# EasyEDA schematic SCH_gravmaskin_mottagare_2024-06-04.json
TITLE: Sheet_1; REV: 1.0; Date: 2024-06-04; Sheet: 1/1; Company: Your Company
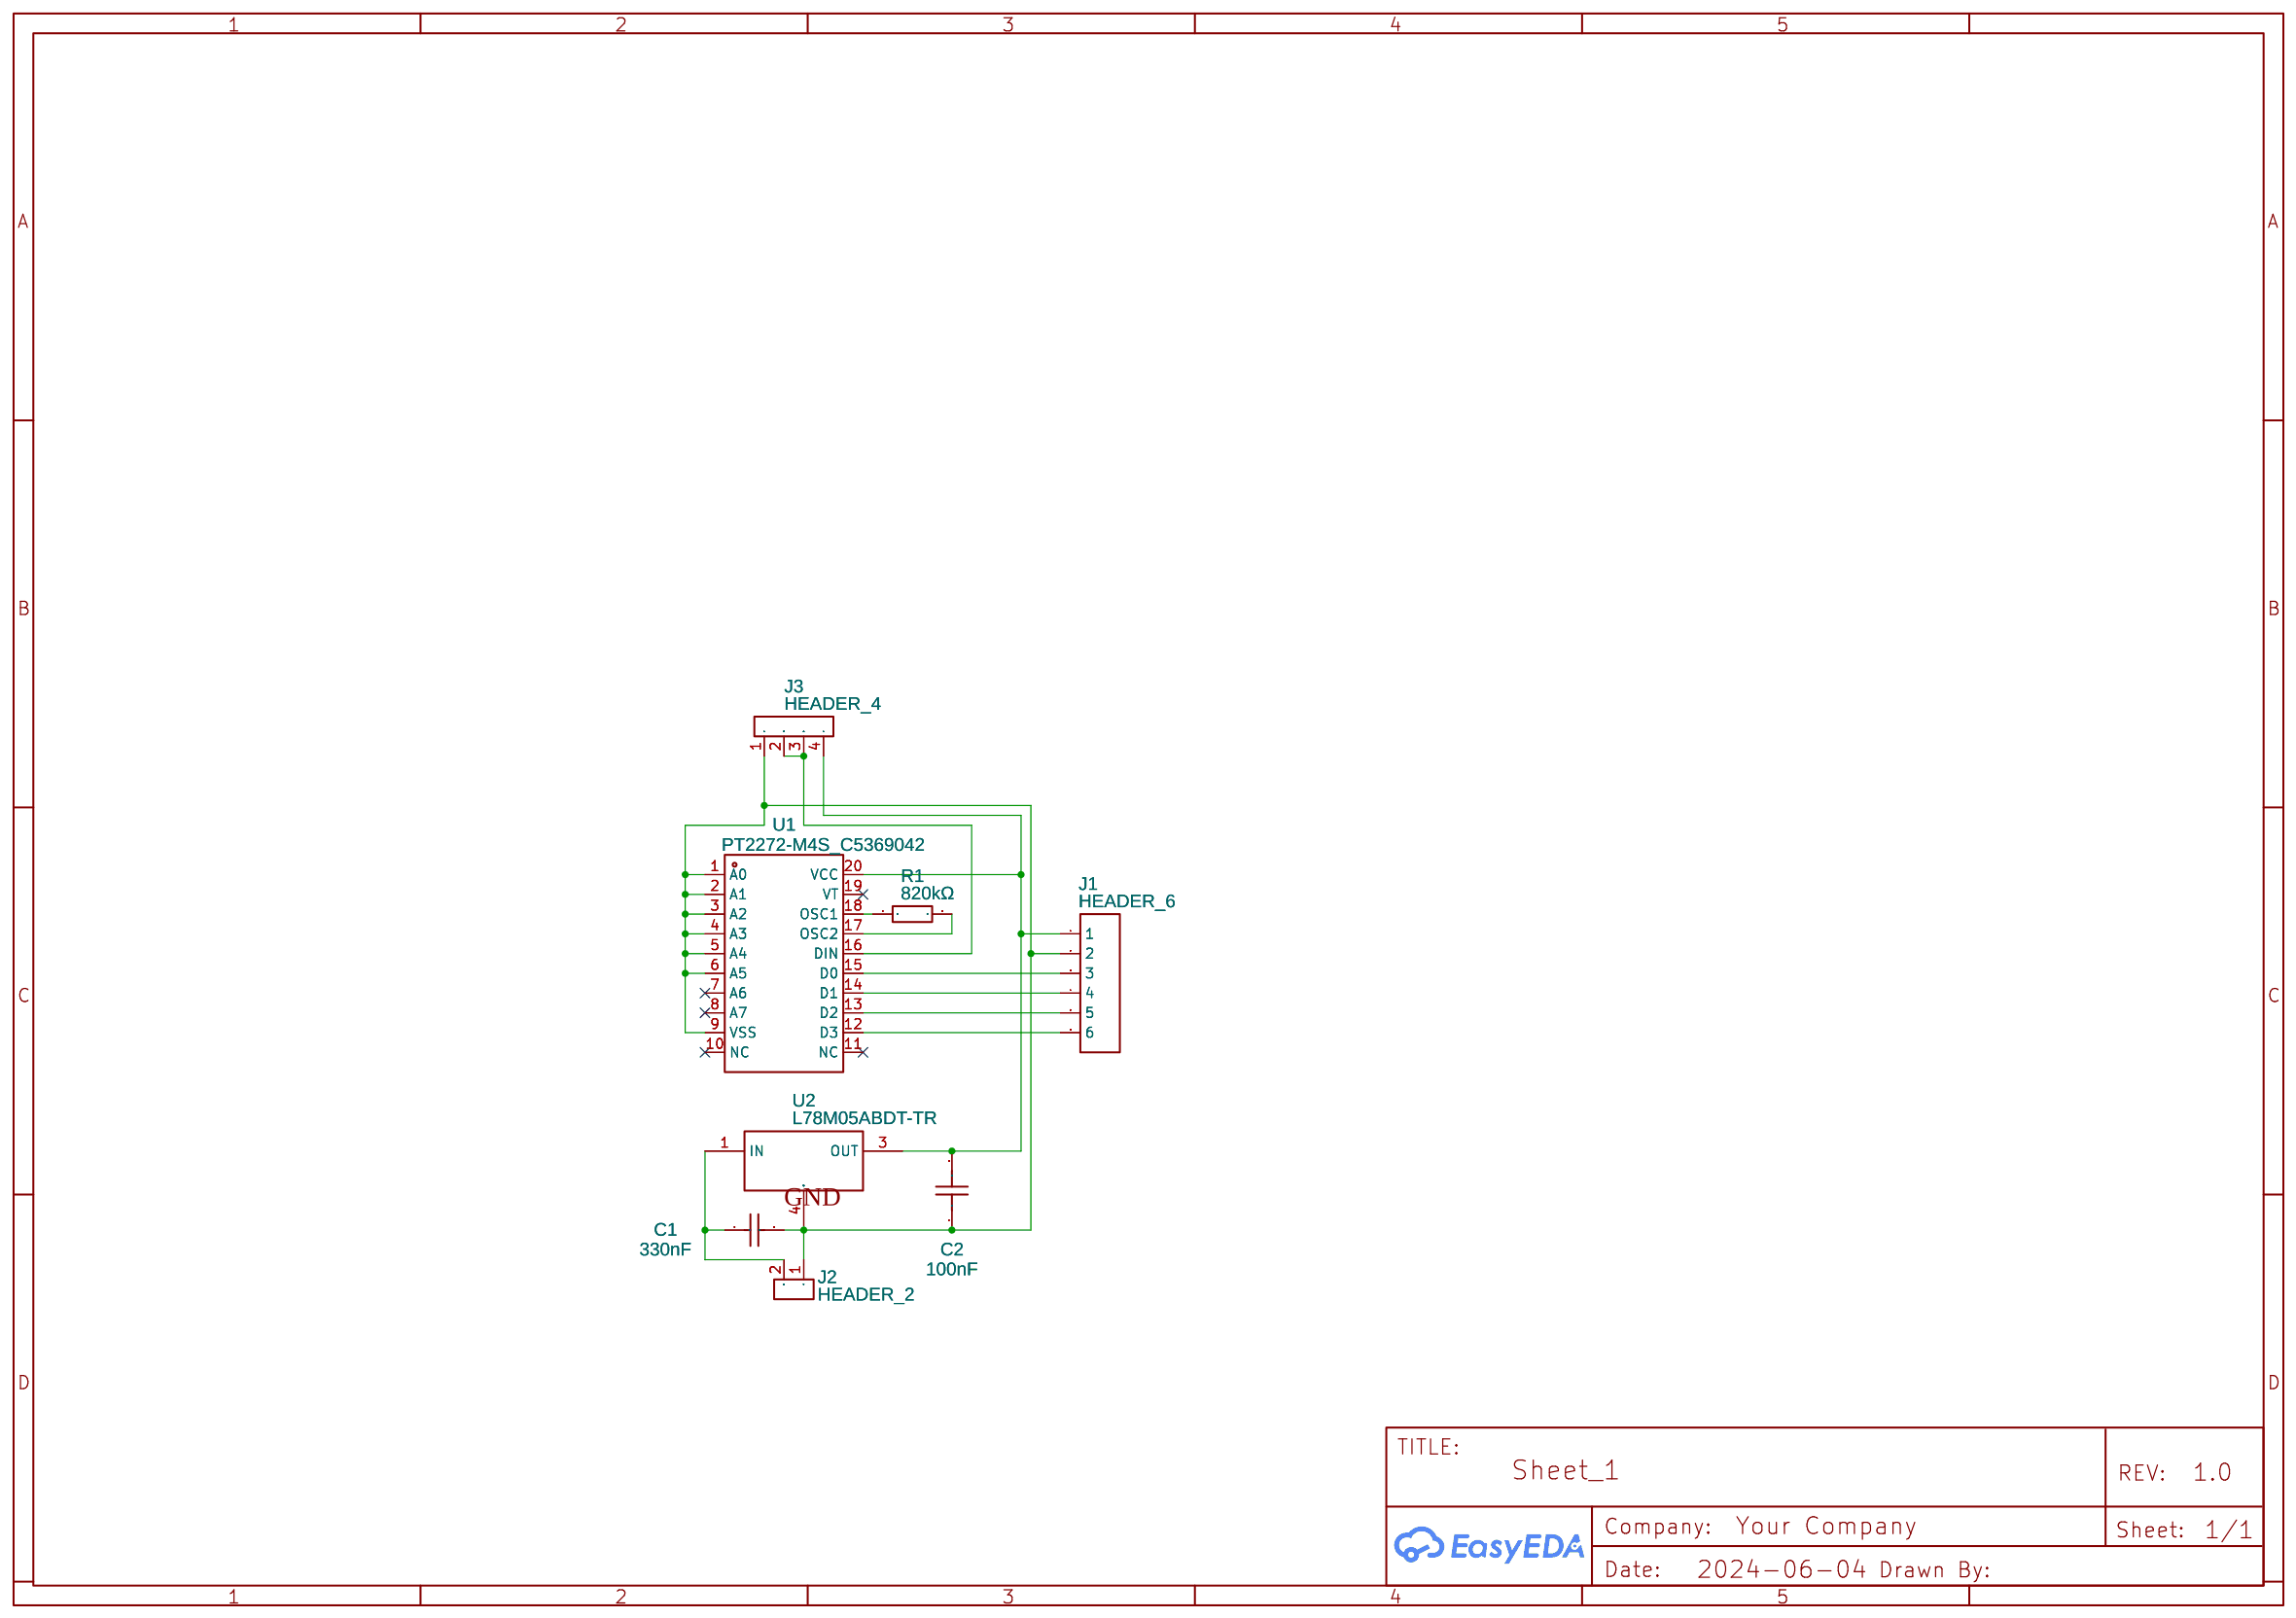
[diagram p0: schematic sheet]

## Parts
C1  330nF  [C0603]
C2  100nF  [C0603]
J1  HEADER_6  [HDR-M-2.54_1X6]
J2  HEADER_2  [1X02]
J3  HEADER_4  [1X04]
R1  820kΩ  [R0201]
U1  PT2272-M4S_C5369042  [SOIC-20_L13.0-W7.6-P1.27-LS10.3-BL]
U2  L78M05ABDT-TR  [TO-252-2_L6.5-W6.1-P4.58-LS10.0-TL]

## Library data of the parts
C1 = 0603B334K250NT: Supplier: LCSC; Manufacturer: FH(风华); Supplier Part: C1615; JLCPCB Part Class: Extended Part
C2 = CC0603KRX7R9BB104: Supplier: LCSC; Manufacturer: YAGEO(国巨); Supplier Part: C14663; JLCPCB Part Class: Basic Part
J1 = HEADER_6
J2 = HEADER_2
J3 = HEADER_4
R1 = RC-01W824JT: Contributor: LCSC; Supplier: LCSC; Supplier Part: C321058; Manufacturer: FH(风华); JLCPCB Part Class: Extended Part
U1 = PT2272-M4S_C5369042: Contributor: lcsc; Supplier: LCSC; Supplier Part: C5369042; Manufacturer: PTC(普诚); Manufacturer Part: PT2272-M4S; JLCPCB Part Class: Extended Part
U2 = L78M05ABDT-TR: Supplier: LCSC; Manufacturer: ST(意法半导体); Supplier Part: C58069; JLCPCB Part Class: Basic Part

## Nets
Net-(C1-1): C1.1 C2.1 J1.2 J2.1 J3.1 U1.1(A0) U1.2(A1) U1.3(A2) U1.4(A3) U1.5(A4) U1.6(A5) U1.9(VSS) U2.4(GND)
Net-(C1-2): C1.2 J2.2 U2.1(IN)
Net-(C2-2): C2.2 J1.1 J3.4 U1.20(VCC) U2.3(OUT)
Net-(J1-3): J1.3 U1.15(D0)
Net-(J1-4): J1.4 U1.14(D1)
Net-(J1-5): J1.5 U1.13(D2)
Net-(J1-6): J1.6 U1.12(D3)
Net-(J3-2): J3.2 J3.3 U1.16(DIN)
Net-(R1-1): R1.1 U1.18(OSC1)
Net-(R1-2): R1.2 U1.17(OSC2)

Not connected (* = marked no-connect by the designer): U1 7(A6)* 8(A7)* 10(NC)* 11(NC)* 19(VT)*
